# Altium schematic sheet LTC2949.SchDoc: LTC2949 Test Board
size A4; Author: Leo Xie & Naveela Sookoo; Organization: Waterloop; Address1: 200 University Avenue W; Address2: Engineering 5 ,1104; Address3: Waterloo, Ontario; Address4: N2L 3G1; DocumentNumber: 2; Revision: 1; SheetNumber: 2; SheetTotal: 3
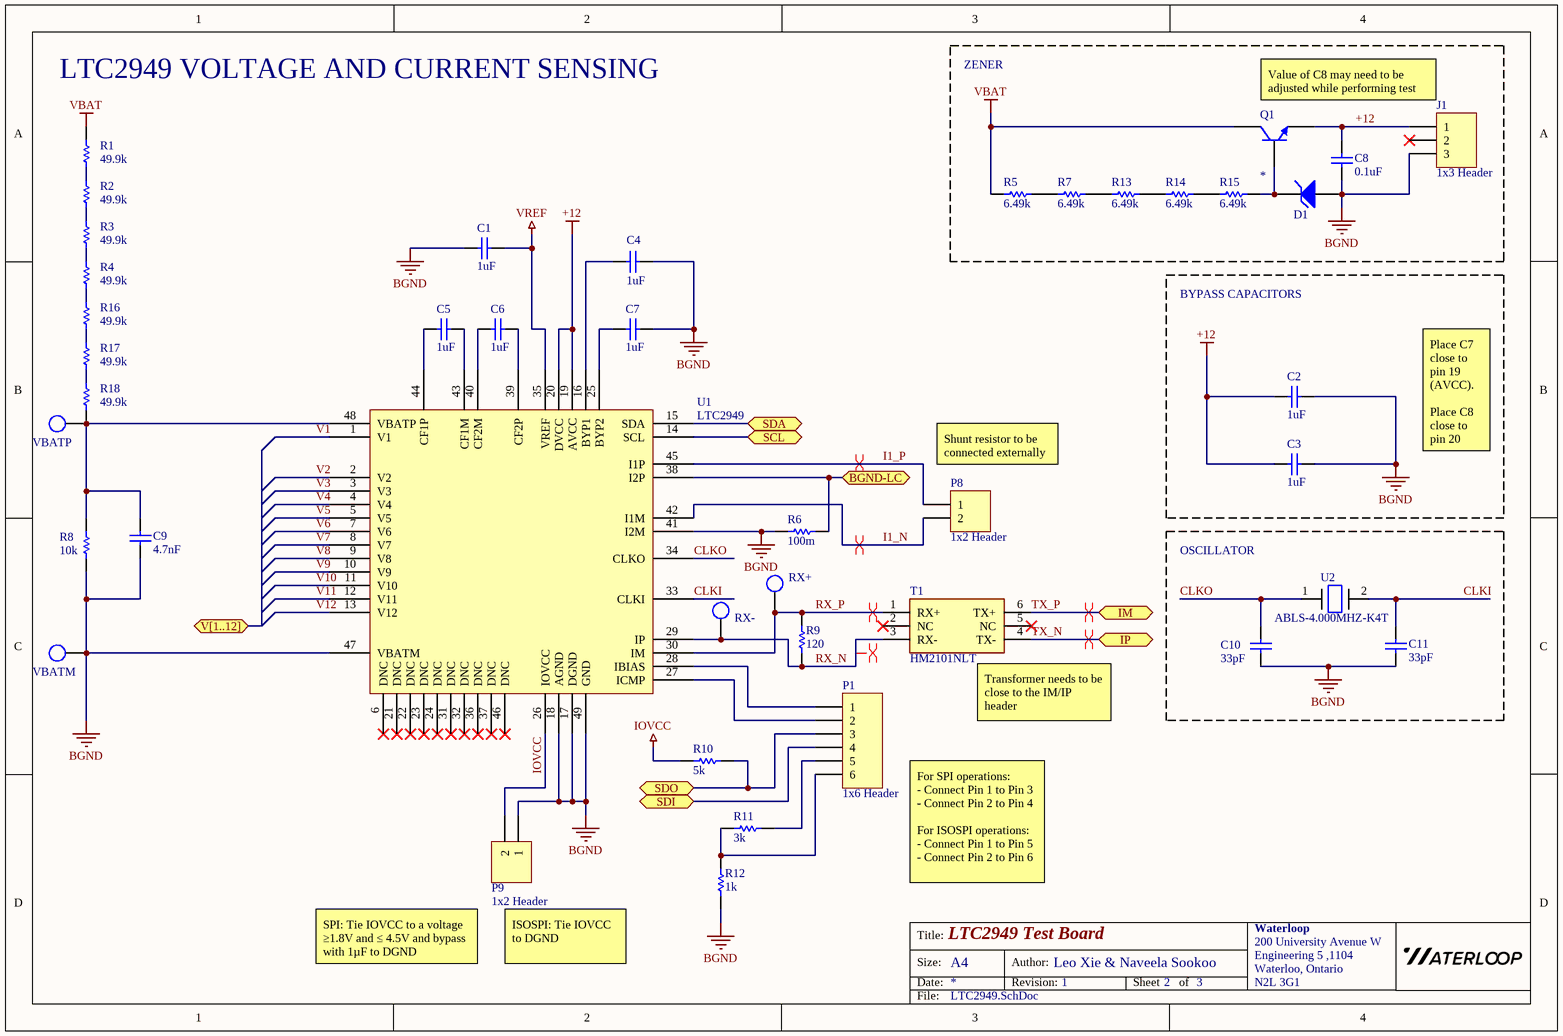
[diagram p0: LTC2949.SchDoc]

## Parts
C1  value 1uF  [0805 - Capacitor]  (hidden comment: Capacitor - Nonpolarized)
C2  value 1uF  [0805 - Capacitor]  (hidden comment: Nonpolarized Capacitor)
C3  value 1uF  [0805 - Capacitor]  (hidden comment: Nonpolarized Capacitor)
C4  value 1uF  [0805 - Capacitor]  (hidden comment: Nonpolarized Capacitor)
C5  value 1uF  [0805 - Capacitor]  (hidden comment: Nonpolarized Capacitor)
C6  value 1uF  [0805 - Capacitor]  (hidden comment: Nonpolarized Capacitor)
C7  value 1uF  [0805 - Capacitor]  (hidden comment: Nonpolarized Capacitor)
C8  value 0.1uF  [0805 - Capacitor]  (hidden comment: Nonpolarized Capacitor)
C9  value 4.7nF  [0805 - Capacitor]  (hidden comment: Nonpolarized Capacitor)
C10  value 33pF  [0805 - Capacitor]  (hidden comment: Nonpolarized Capacitor)
C11  value 33pF  [0805 - Capacitor]  (hidden comment: Nonpolarized Capacitor)
D1  Zener  [BZD27C - ZENER DIODES]  (value not drawn)
J1  1x3 Header  [HDR1X3]
P1  1x6 Header  [HDR1X6]
P8  1x2 Header  [HDR1X2]
P9  1x2 Header  [HDR1X2]
Q1  NPN  [BJT NPN 800 V 4 A - 90 W Through Hole TO-220]  (value not drawn)
R1  value 49.9k  [1206 - Resistor]  (hidden comment: Resistor)
R2  value 49.9k  [1206 - Resistor]  (hidden comment: Resistor)
R3  value 49.9k  [1206 - Resistor]  (hidden comment: Resistor)
R4  value 49.9k  [1206 - Resistor]  (hidden comment: Resistor)
R5  value 6.49k  [0603 - Resistor]  (hidden comment: Resistor)
R6  value 100m  [0603 - Resistor]  (hidden comment: Resistor)
R7  value 6.49k  [0603 - Resistor]  (hidden comment: Resistor)
R8  value 10k  [0603 - Resistor]  (hidden comment: Resistor)
R9  value 120  [0603 - Resistor]  (hidden comment: Resistor)
R10  value 5k  [0603 - Resistor]  (hidden comment: Resistor)
R11  value 3k  [0603 - Resistor]  (hidden comment: Resistor)
R12  value 1k  [0603 - Resistor]  (hidden comment: Resistor)
R13  value 6.49k  [0603 - Resistor]  (hidden comment: Resistor)
R14  value 6.49k  [0603 - Resistor]  (hidden comment: Resistor)
R15  value 6.49k  [0603 - Resistor]  (hidden comment: Resistor)
R16  value 49.9k  [1206 - Resistor]  (hidden comment: Resistor)
R17  value 49.9k  [1206 - Resistor]  (hidden comment: Resistor)
R18  value 49.9k  [1206 - Resistor]  (hidden comment: Resistor)
RX+  Test Point  [Test Point - 5002]  (value not drawn)  (no BOM)
RX-  Test Point  [Test Point - 5002]  (value not drawn)  (no BOM)
T1  HM2101NLT  [HM2101NLT]
U1  LTC2949  [LTC2949]
U2  ABLS-4.000MHZ-K4T  [ABLS_4MHZ-K4T]
VBATM  Test Point  [Test Point - 5002]  (value not drawn)  (no BOM)
VBATP  Test Point  [Test Point - 5002]  (value not drawn)  (no BOM)

## Blocks framed on the sheet
ZENER: C8 D1 J1 Q1 R5 R7 R13-R15
BYPASS CAPACITORS: C2 C3
OSCILLATOR: C10 C11 U2

## Ports
BGND-LC (bidir), IM (bidir), IP (bidir), SCL (bidir), SDA (bidir), SDI (bidir), SDO (bidir), V[1..12] (bidir)

## Nets
+12: C2.1 C3.1 C8.1 J1.1 Q1.3(E) U1.19(AVCC) U1.20(DVCC)
BGND: C1.1 C2.2 C3.2 C4.2 C7.2 C8.2 C9.1 C10.1 C11.1 D1.1(A) J1.3 P9.1 R6.1 R8.1 R12.2 U1.17(DGND) U1.18(AGND) U1.41(I2M) U1.47(VBATM) U1.49(GND) VBATM.1
IOVCC: P9.2 R10.1 U1.26(IOVCC)
VBAT: Q1.1(C) R1.2 R5.2
VREF: C1.2 U1.35(VREF)
BGND-LC: R6.2 U1.38(I2P) ; port BGND-LC
CLKI: C11.2 U1.33(CLKI) U2.2
CLKO: C10.2 U1.34(CLKO) U2.1
I1_N: P8.2 U1.42(I1M)
I1_P: P8.1 U1.45(I1P)
RX_N: R9.1 RX-.1 T1.3(RX-) U1.29(IP)
RX_P: R9.2 RX+.1 T1.1(RX+) U1.30(IM)
SCL: U1.14(SCL) ; port SCL
SDA: U1.15(SDA) ; port SDA
SDI: P1.4 ; port SDI
SDO: P1.3 R10.2 ; port SDO
TX_N: T1.4(TX-) ; port IP
TX_P: T1.6(TX+) ; port IM
V1: U1.1(V1)
V2: U1.2(V2)
V3: U1.3(V3)
V4: U1.4(V4)
V5: U1.5(V5)
V6: U1.7(V6)
V7: U1.8(V7)
V8: U1.9(V8)
V9: U1.10(V9)
V10: U1.11(V10)
V11: U1.12(V11)
V12: U1.13(V12)
NetC4_1: C4.1 U1.16(BYP1)
NetC5_1: C5.1 U1.44(CF1P)
NetC5_2: C5.2 U1.43(CF1M)
NetC6_1: C6.1 U1.40(CF2M)
NetC6_2: C6.2 U1.39(CF2P)
NetC7_1: C7.1 U1.25(BYP2)
NetC9_2: C9.2 R8.2 R18.1 U1.48(VBATP) VBATP.1
NetD1_2: D1.2(K) Q1.2(B) R15.1
NetP1_1: P1.1 U1.28(IBIAS)
NetP1_2: P1.2 U1.27(ICMP)
NetP1_5: P1.5 R11.2
NetP1_6: P1.6 R11.1 R12.1
NetR1_1: R1.1 R2.2
NetR2_1: R2.1 R3.2
NetR3_1: R3.1 R4.2
NetR4_1: R4.1 R16.2
NetR5_1: R5.1 R7.2
NetR7_1: R7.1 R13.2
NetR13_1: R13.1 R14.2
NetR14_1: R14.1 R15.2
NetR16_1: R16.1 R17.2
NetR17_1: R17.1 R18.2

Not connected (* = marked no-connect by the designer): J1 2*; T1 2(NC)* 5(NC)*; U1 6(DNC)* 21(DNC)* 22(DNC)* 23(DNC)* 24(DNC)* 31(DNC)* 32(DNC)* 36(DNC)* 37(DNC)* 46(DNC)*

## Layout directives
differential pair: I1_N, I1_P, RX_N, RX_P, TX_N, TX_P

## Notes on the sheet
- LTC2949 VOLTAGE AND CURRENT SENSING
- Value of C8 may need to be adjusted while performing test
- Place C7 close to pin 19 (AVCC).
  Place C8 close to pin 20 (DVCC).
- (near P8) Shunt resistor to be connected externally
- (near T1) Transformer needs to be close to the IM/IP header
- For SPI operations:
  - Connect Pin 1 to Pin 3
  - Connect Pin 2 to Pin 4
  For ISOSPI operations:
  - Connect Pin 1 to Pin 5
  - Connect Pin 2 to Pin 6
- SPI: Tie IOVCC to a voltage ≥1.8V and ≤ 4.5V and bypass with 1µF to DGND
- ISOSPI: Tie IOVCC to DGND
- Title:
- Size:
- Date:
- A4
- Author:
- Revision:
- Sheet
- of
- File:

## Library data of the parts
C1 = Capacitor - Nonpolarized: Nonpolarized Capacitor; Supplier Part Number: *; Supplier: *; Manufacturer: *; Rating: *; Manufacturer Part Number: *
C2-C11 = Capacitor - Nonpolarized: Supplier Part Number: *; Supplier: *; Manufacturer: *; Rating: *; Manufacturer Part Number: *
D1 = Zener: Zener Diode; Manufacturer Part Number: *; Manufacturer: *; Supplier: *; Supplier Part Number: *; Value: *
J1 = 1x3 Header: 1x3 Pin Header
P1 = 1x6 Header: 1x6 Pin Header
P8 P9 = 1x2 Header: 1x2 Pin Header
Q1 = NPN: NPN Bipolar Transistor; Rating: *; Manufacturer: *; Manufacturer Part Number: *; Supplier: *; Supplier Part Number: *; Value: *
T1 = HM2101NLT: Pulse Transformer 1:1 Surface Mount 150µH, 450µH
U1 = LTC2949: Manufacturer: Analog Devices; Manufacturer Part Number: LTC2949ILXE#3ZZPBF; Supplier: Mouser; Supplier Part Number: 584-2949ILXE3ZZPBF
U2 = ABLS-4.000MHZ-K4T: Crystal Oscillator 4MHz 18pF
R1-R18 = Resistor: Rating: *; Manufacturer Part Number: *; Manufacturer: *; Supplier Part Number: *; Supplier: *